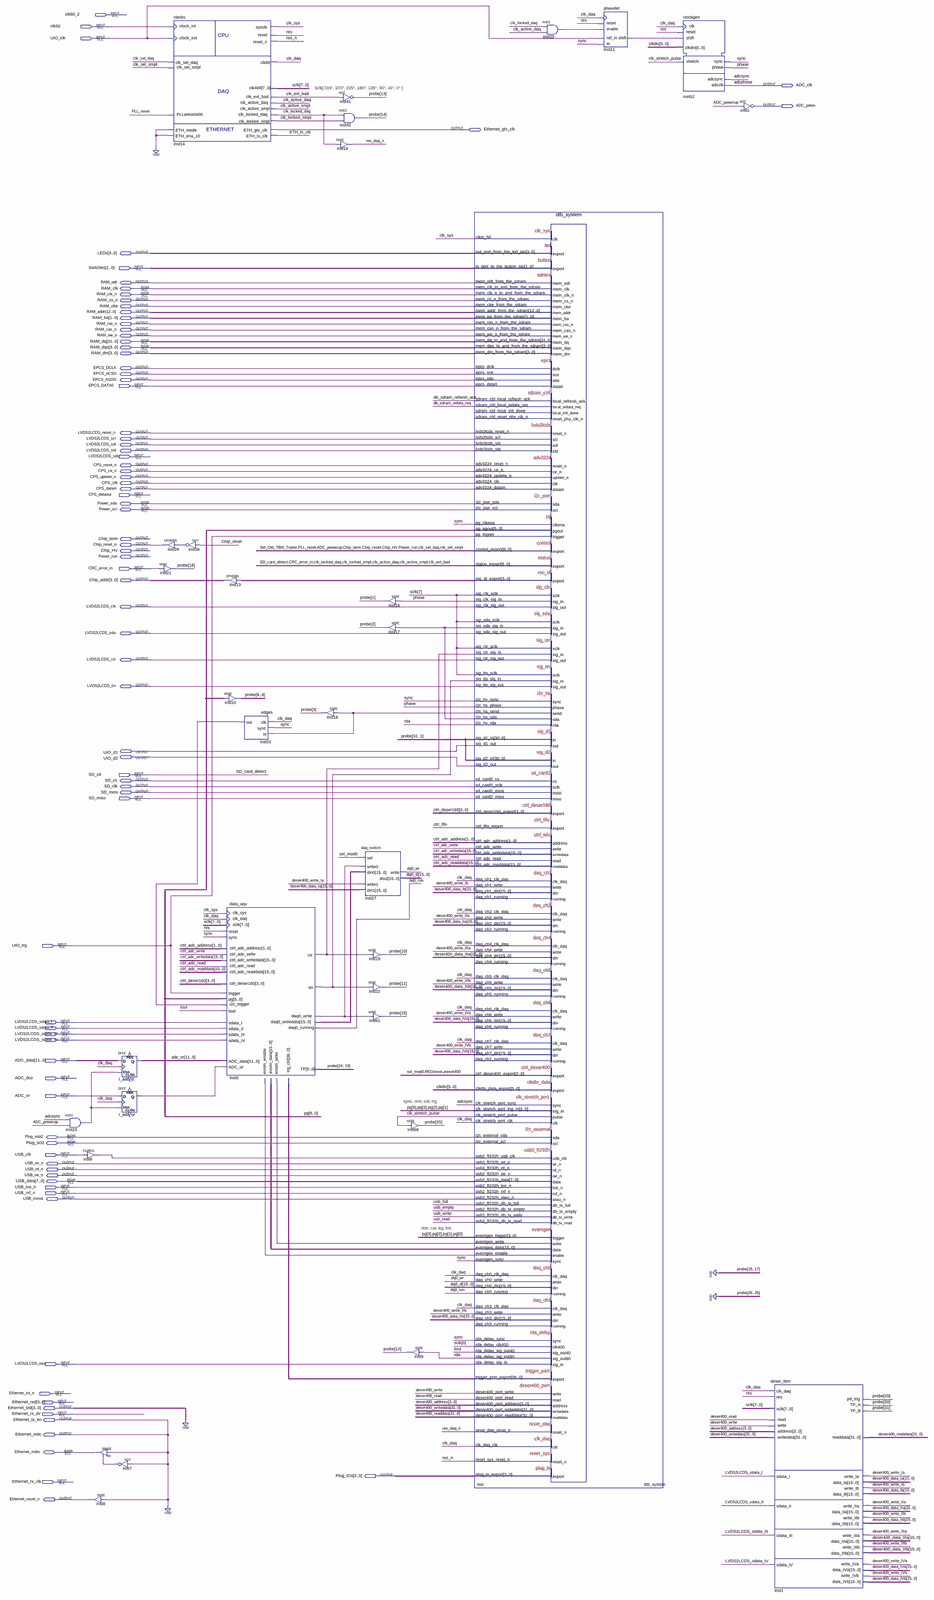
[diagram p0: schematic sheet, whole]
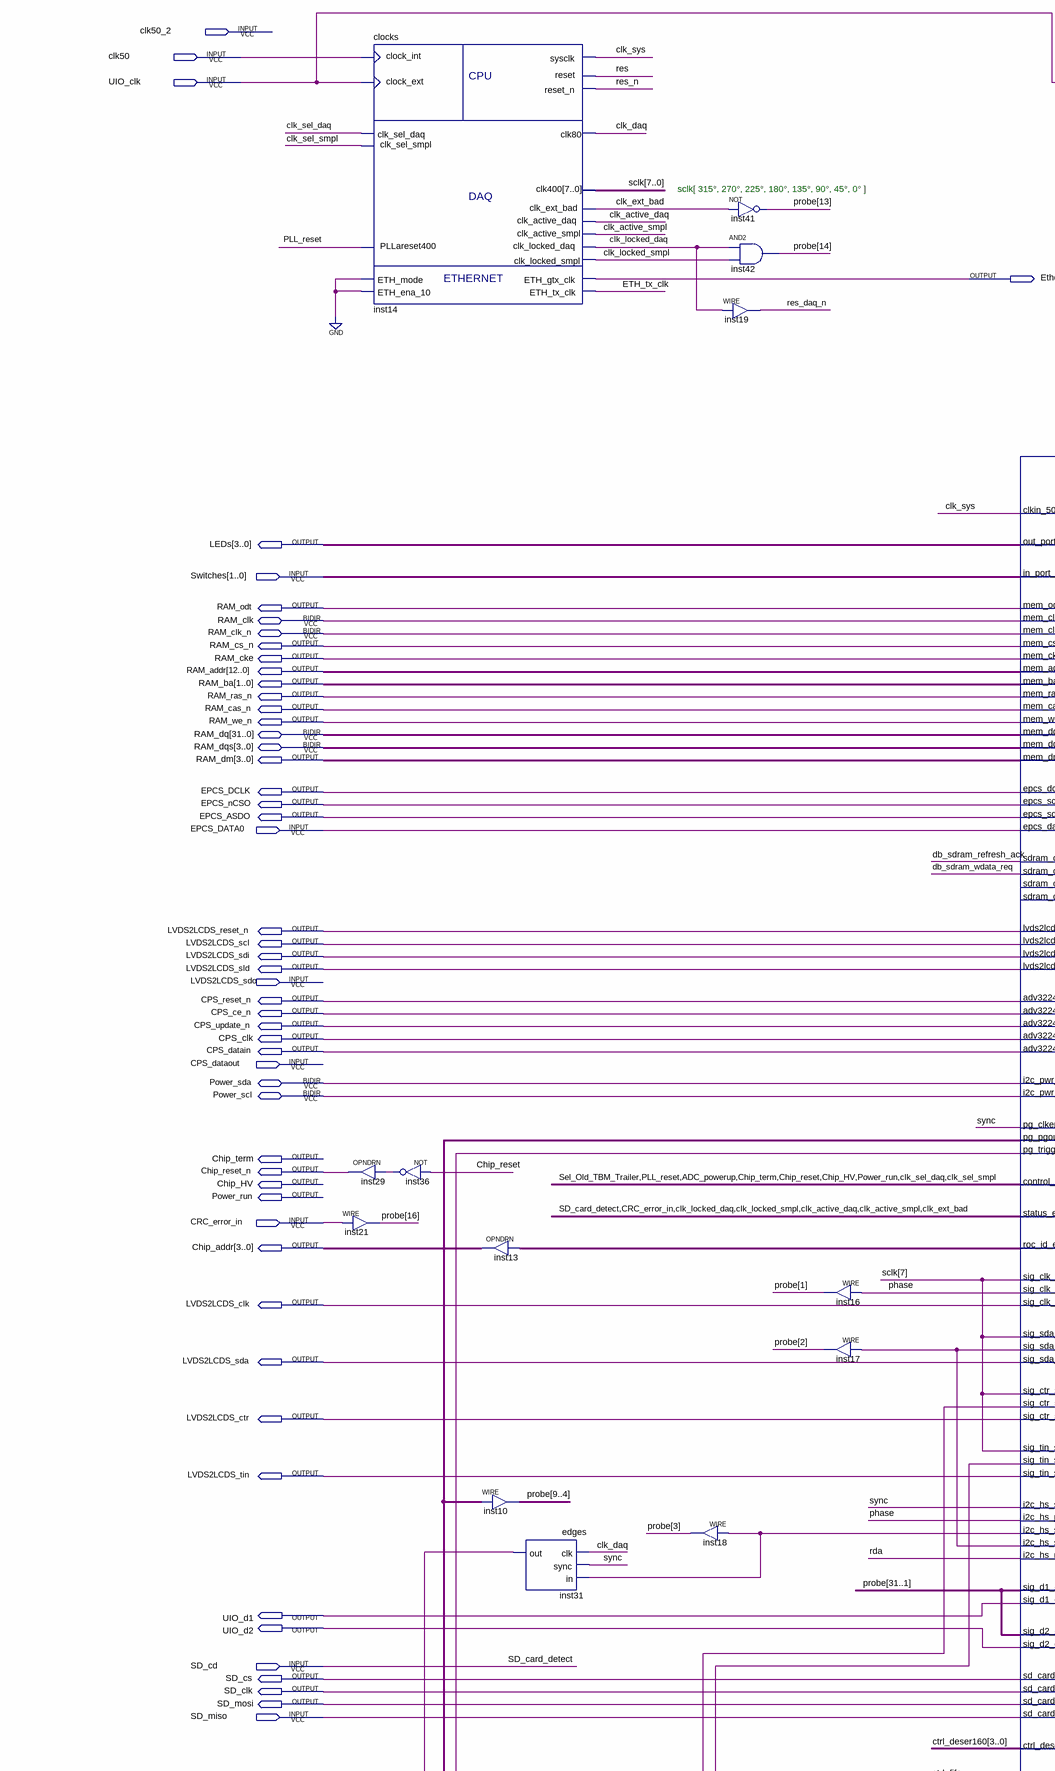
[diagram p1: schematic sheet, upper left part]
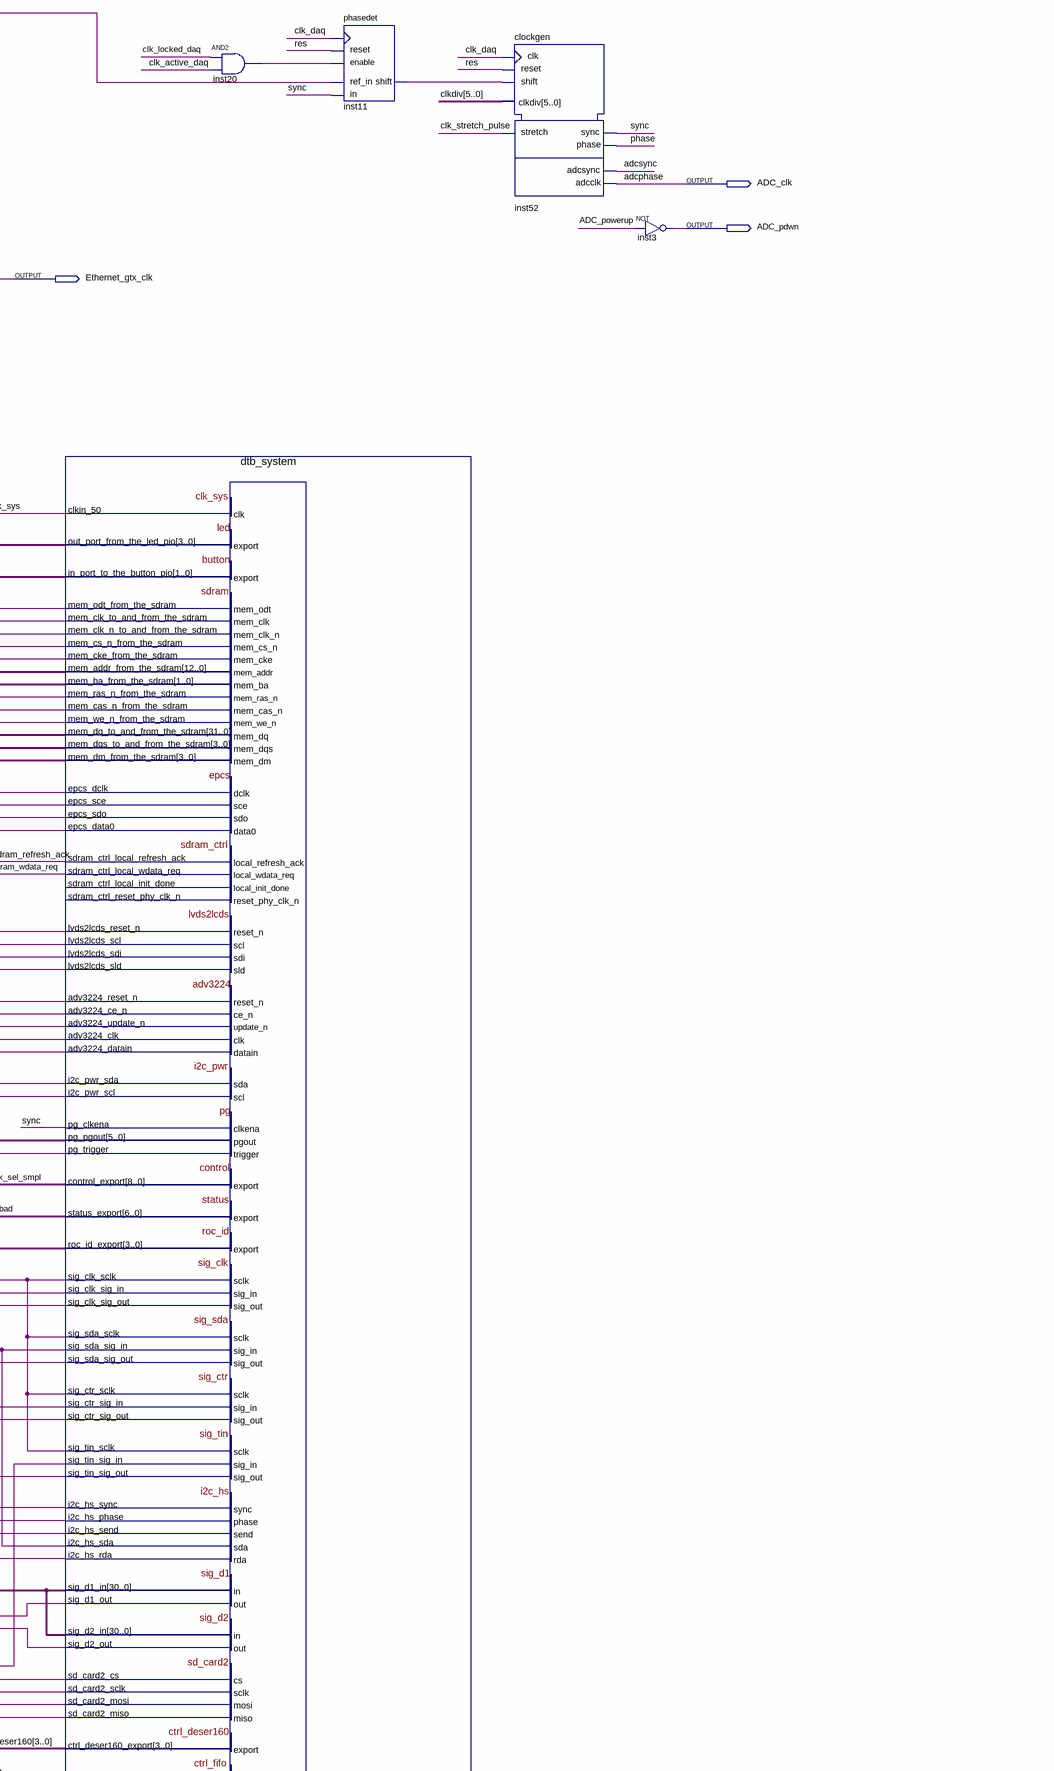
[diagram p2: schematic sheet, upper right part]
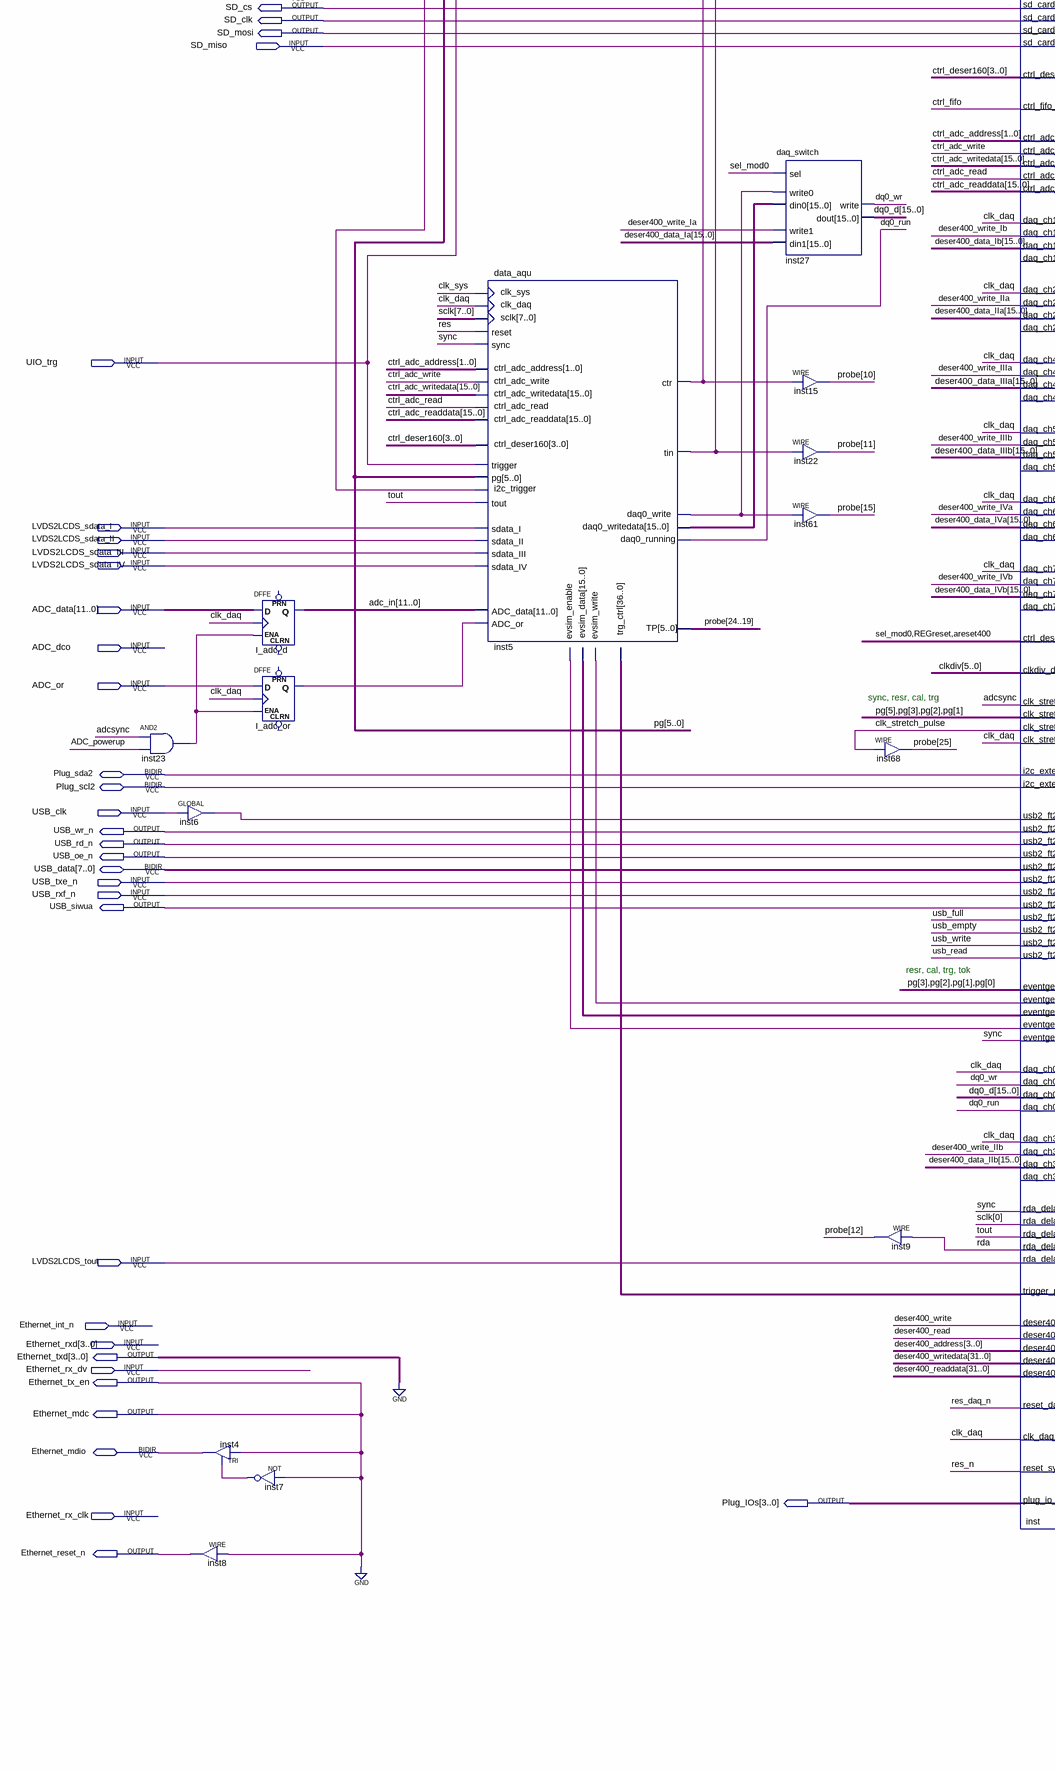
[diagram p3: schematic sheet, lower left part]
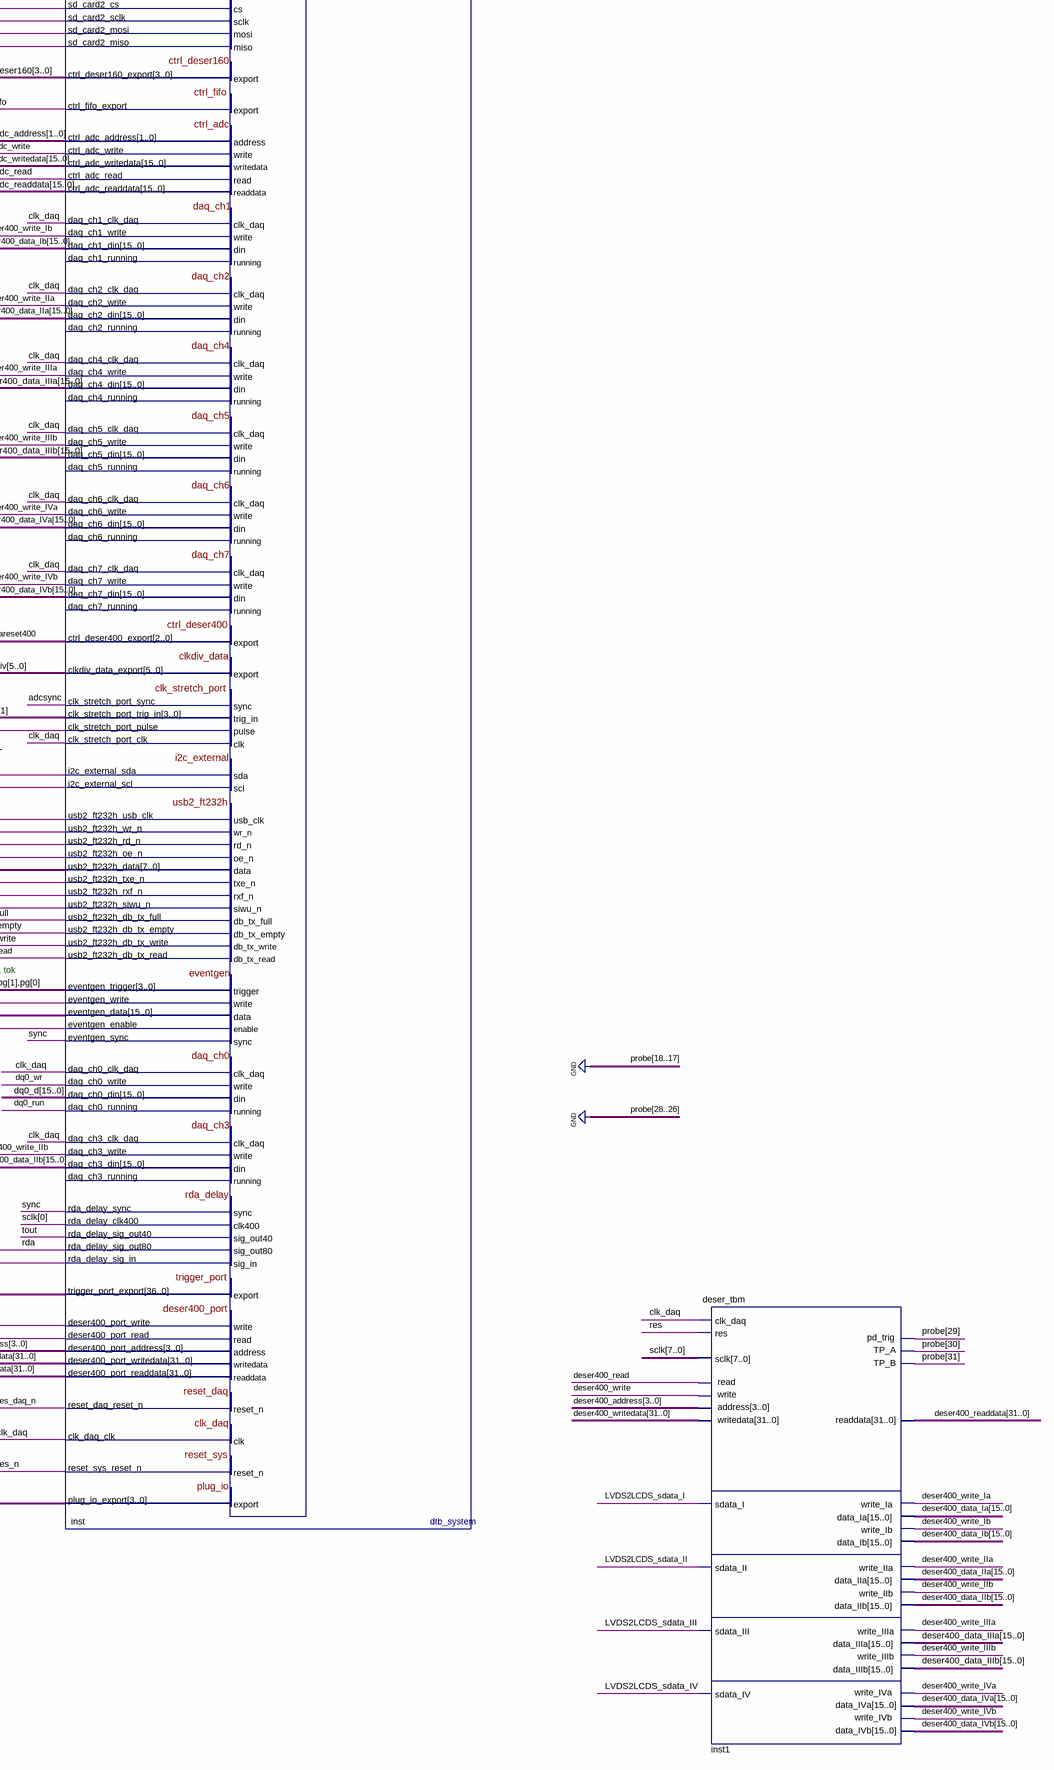
[diagram p4: schematic sheet, lower right part]
// Quartus schematic dtb.bdf as structural Verilog: 33 symbols, 84 pins
module dtb (
  input  clk50_2,
  input  clk50,
  input  UIO_clk,
  input  [1:0] Switches,
  input  EPCS_DATA0,
  input  LVDS2LCDS_sdo,
  input  CPS_dataout,
  input  CRC_error_in,
  input  SD_cd,
  input  SD_miso,
  input  UIO_trg,
  input  LVDS2LCDS_sdata_I,
  input  LVDS2LCDS_sdata_II,
  input  LVDS2LCDS_sdata_III,
  input  LVDS2LCDS_sdata_IV,
  input  [11:0] ADC_data,
  input  ADC_dco,
  input  ADC_or,
  input  USB_clk,
  input  USB_txe_n,
  input  USB_rxf_n,
  input  LVDS2LCDS_tout,
  input  Ethernet_int_n,
  input  [3:0] Ethernet_rxd,
  input  Ethernet_rx_dv,
  input  Ethernet_rx_clk,
  inout  RAM_clk,
  inout  RAM_clk_n,
  inout  [31:0] RAM_dq,
  inout  [3:0] RAM_dqs,
  inout  Power_sda,
  inout  Power_scl,
  inout  Plug_sda2,
  inout  Plug_scl2,
  inout  [7:0] USB_data,
  inout  Ethernet_mdio,
  output ADC_clk,
  output ADC_pdwn,
  output Ethernet_gtx_clk,
  output [3:0] LEDs,
  output RAM_odt,
  output RAM_cs_n,
  output RAM_cke,
  output [12:0] RAM_addr,
  output [1:0] RAM_ba,
  output RAM_ras_n,
  output RAM_cas_n,
  output RAM_we_n,
  output [3:0] RAM_dm,
  output EPCS_DCLK,
  output EPCS_nCSO,
  output EPCS_ASDO,
  output LVDS2LCDS_reset_n,
  output LVDS2LCDS_scl,
  output LVDS2LCDS_sdi,
  output LVDS2LCDS_sld,
  output CPS_reset_n,
  output CPS_ce_n,
  output CPS_update_n,
  output CPS_clk,
  output CPS_datain,
  output Chip_term,
  output Chip_reset_n,
  output Chip_HV,
  output Power_run,
  output [3:0] Chip_addr,
  output LVDS2LCDS_clk,
  output LVDS2LCDS_sda,
  output LVDS2LCDS_ctr,
  output LVDS2LCDS_tin,
  output UIO_d1,
  output UIO_d2,
  output SD_cs,
  output SD_clk,
  output SD_mosi,
  output USB_wr_n,
  output USB_rd_n,
  output USB_oe_n,
  output USB_siwua,
  output [3:0] Ethernet_txd,
  output Ethernet_tx_en,
  output Ethernet_mdc,
  output [3:0] Plug_IOs,
  output Ethernet_reset_n
);

  wire ADC_powerup, adcsync, areset400, Chip_reset, clk_active_daq, clk_active_smpl, clk_daq, clk_ext_bad,
       clk_locked_daq, clk_locked_smpl, clk_sel_daq, clk_sel_smpl, clk_stretch_pulse, clk_sys, ctrl_adc_read,
       ctrl_adc_write, ctrl_fifo, db_sdram_refresh_ack, db_sdram_wdata_req, deser400_read, deser400_write,
       deser400_write_Ia, deser400_write_Ib, deser400_write_IIa, deser400_write_IIb, deser400_write_IIIa,
       deser400_write_IIIb, deser400_write_IVa, deser400_write_IVb, dq0_run, dq0_wr, ETH_tx_clk, I_adc_or_q,
       inst5_ctr, inst5_daq0_write, inst5_tin, inst6_out, inst7_out, inst11_shift, inst20_out, inst23_out,
       inst31_out, inst36_out, inst_eventgen_enable, inst_eventgen_write, inst_i2c_hs_sda, inst_i2c_hs_send,
       phase, PLL_reset, rda, REGreset, res, res_daq_n, res_n, sel_mod0, Sel_Old_TBM_Trailer, sync, tout,
       usb_empty, usb_full, usb_read, usb_write;
  wire [1:0] ctrl_adc_address;
  wire [3:0] ctrl_deser160, deser400_address, inst_roc_id_export;
  wire [5:0] clkdiv, pg;
  wire [7:0] sclk;
  wire [11:0] adc_in;
  wire [15:0] ctrl_adc_readdata, ctrl_adc_writedata, deser400_data_Ia, deser400_data_Ib, deser400_data_IIa,
       deser400_data_IIb, deser400_data_IIIa, deser400_data_IIIb, deser400_data_IVa, deser400_data_IVb,
       dq0_d, inst5_daq0_writedata, inst_eventgen_data;
  wire [31:0] deser400_readdata, deser400_writedata;
  wire [31:1] probe;
  wire [36:0] inst_trigger_port_export;

  and inst23 (inst23_out, adcsync, ADC_powerup);
  GLOBAL inst6 (.IN(USB_clk), .OUT(inst6_out));
  assign Ethernet_reset_n = 1'b0;  // WIRE inst8
  TRI inst4 (.IN(1'b0), .OE(inst7_out), .OUT(Ethernet_mdio));
  DFFE I_adc_d[11:0] (.D(ADC_data), .CLK(clk_daq), .ENA(inst23_out), .Q(adc_in));  // open: PRN, CLRN
  DFFE I_adc_or (.D(ADC_or), .CLK(clk_daq), .ENA(inst23_out), .Q(I_adc_or_q));  // open: PRN, CLRN
  not inst7 (inst7_out, 1'b0);
  assign probe[16] = CRC_error_in;  // WIRE inst21
  clocks inst14 (
    .clock_int(clk50), .clock_ext(UIO_clk), .clk_sel_daq(clk_sel_daq), .ETH_mode(1'b0), .ETH_ena_10(1'b0),
    .PLLareset400(PLL_reset), .clk_sel_smpl(clk_sel_smpl), .sysclk(clk_sys), .reset_n(res_n),
    .ETH_gtx_clk(Ethernet_gtx_clk), .ETH_tx_clk(ETH_tx_clk), .reset(res), .clk80(clk_daq), .clk400(sclk),
    .clk_active_smpl(clk_active_smpl), .clk_active_daq(clk_active_daq), .clk_ext_bad(clk_ext_bad),
    .clk_locked_daq(clk_locked_daq), .clk_locked_smpl(clk_locked_smpl));
  OPNDRN inst29 (.IN(inst36_out), .OUT(Chip_reset_n));
  not inst36 (inst36_out, Chip_reset);
  OPNDRN inst13[3:0] (.IN(inst_roc_id_export), .OUT(Chip_addr));
  assign probe[9:4] = pg;  // WIRE inst10
  data_aqu inst5 (
    .clk_daq(clk_daq), .reset(res), .sync(sync), .trigger(UIO_trg), .tout(tout), .sdata_I(LVDS2LCDS_sdata_I),
    .sdata_II(LVDS2LCDS_sdata_II), .sdata_III(LVDS2LCDS_sdata_III), .sdata_IV(LVDS2LCDS_sdata_IV),
    .ADC_or(I_adc_or_q), .ADC_data(adc_in), .pg(pg), .clk_sys(clk_sys), .sclk(sclk),
    .ctrl_deser160(ctrl_deser160), .daq0_running(dq0_run), .ctrl_adc_address(ctrl_adc_address),
    .ctrl_adc_write(ctrl_adc_write), .ctrl_adc_writedata(ctrl_adc_writedata), .ctrl_adc_read(ctrl_adc_read),
    .i2c_trigger(inst31_out), .evsim_enable(inst_eventgen_enable), .evsim_write(inst_eventgen_write),
    .evsim_data(inst_eventgen_data), .trg_ctrl(inst_trigger_port_export), .ctr(inst5_ctr), .tin(inst5_tin),
    .daq0_write(inst5_daq0_write), .daq0_writedata(inst5_daq0_writedata),
    .ctrl_adc_readdata(ctrl_adc_readdata), .TP(probe[24:19]));
  edges inst31 (.clk(clk_daq), .sync(sync), .in(inst_i2c_hs_send), .out(inst31_out));
  assign probe[3] = inst_i2c_hs_send;  // WIRE inst18
  not inst41 (probe[13], clk_ext_bad);
  and inst42 (probe[14], clk_locked_daq, clk_locked_smpl);
  assign res_daq_n = clk_locked_daq;  // WIRE inst19
  daq_switch inst27 (
    .sel(sel_mod0), .write0(inst5_daq0_write), .din0(inst5_daq0_writedata), .write1(deser400_write_Ia),
    .din1(deser400_data_Ia), .write(dq0_wr), .dout(dq0_d));
  assign probe[10] = inst5_ctr;  // WIRE inst15
  assign probe[11] = inst5_tin;  // WIRE inst22
  assign probe[15] = inst5_daq0_write;  // WIRE inst61
  assign probe[1] = phase;  // WIRE inst16
  assign probe[2] = inst_i2c_hs_sda;  // WIRE inst17
  assign probe[25] = clk_stretch_pulse;  // WIRE inst68
  assign probe[12] = rda;  // WIRE inst9
  dtb_system inst (
    .clkin_50(clk_sys), .in_port_to_the_button_pio(Switches), .epcs_data0(EPCS_DATA0), .pg_clkena(sync),
    .pg_trigger(UIO_trg),
    .status_export({SD_cd, CRC_error_in, clk_locked_daq, clk_locked_smpl, clk_active_daq, clk_active_smpl, clk_ext_bad}),
    .sig_clk_sclk(sclk[7]), .sig_clk_sig_in(phase), .sig_sda_sclk(sclk[7]), .sig_sda_sig_in(inst_i2c_hs_sda),
    .sig_ctr_sclk(sclk[7]), .sig_ctr_sig_in(inst5_ctr), .sig_tin_sclk(sclk[7]), .sig_tin_sig_in(inst5_tin),
    .i2c_hs_sync(sync), .i2c_hs_phase(phase), .i2c_hs_rda(rda),
    .sig_d1_in({probe[31:29], 3'b000, probe[25:19], 2'b00, probe[16:1]}),
    .sig_d2_in({probe[31:29], 3'b000, probe[25:19], 2'b00, probe[16:1]}), .sd_card2_miso(SD_miso),
    .ctrl_adc_readdata(ctrl_adc_readdata), .daq_ch1_clk_daq(clk_daq), .daq_ch1_write(deser400_write_Ib),
    .daq_ch1_din(deser400_data_Ib), .daq_ch2_clk_daq(clk_daq), .daq_ch2_write(deser400_write_IIa),
    .daq_ch2_din(deser400_data_IIa), .daq_ch4_clk_daq(clk_daq), .daq_ch4_write(deser400_write_IIIa),
    .daq_ch4_din(deser400_data_IIIa), .daq_ch5_clk_daq(clk_daq), .daq_ch5_write(deser400_write_IIIb),
    .daq_ch5_din(deser400_data_IIIb), .daq_ch6_clk_daq(clk_daq), .daq_ch6_write(deser400_write_IVa),
    .daq_ch6_din(deser400_data_IVa), .daq_ch7_clk_daq(clk_daq), .daq_ch7_write(deser400_write_IVb),
    .daq_ch7_din(deser400_data_IVb), .clk_stretch_port_sync(adcsync),
    .clk_stretch_port_trig_in({pg[5], pg[3:1]}), .clk_stretch_port_clk(clk_daq),
    .usb2_ft232h_usb_clk(inst6_out), .usb2_ft232h_txe_n(USB_txe_n), .usb2_ft232h_rxf_n(USB_rxf_n),
    .eventgen_trigger(pg[3:0]), .eventgen_sync(sync), .daq_ch0_clk_daq(clk_daq), .daq_ch0_write(dq0_wr),
    .daq_ch0_din(dq0_d), .daq_ch3_clk_daq(clk_daq), .daq_ch3_write(deser400_write_IIb),
    .daq_ch3_din(deser400_data_IIb), .rda_delay_sync(sync), .rda_delay_clk400(sclk[0]),
    .rda_delay_sig_in(LVDS2LCDS_tout), .deser400_port_readdata(deser400_readdata),
    .reset_daq_reset_n(res_daq_n), .clk_daq_clk(clk_daq), .reset_sys_reset_n(res_n),
    .out_port_from_the_led_pio(LEDs), .mem_odt_from_the_sdram(RAM_odt), .mem_cs_n_from_the_sdram(RAM_cs_n),
    .mem_cke_from_the_sdram(RAM_cke), .mem_addr_from_the_sdram(RAM_addr), .mem_ba_from_the_sdram(RAM_ba),
    .mem_ras_n_from_the_sdram(RAM_ras_n), .mem_cas_n_from_the_sdram(RAM_cas_n),
    .mem_we_n_from_the_sdram(RAM_we_n), .mem_dm_from_the_sdram(RAM_dm), .epcs_dclk(EPCS_DCLK),
    .epcs_sce(EPCS_nCSO), .epcs_sdo(EPCS_ASDO), .sdram_ctrl_local_refresh_ack(db_sdram_refresh_ack),
    .sdram_ctrl_local_wdata_req(db_sdram_wdata_req), .lvds2lcds_reset_n(LVDS2LCDS_reset_n),
    .lvds2lcds_scl(LVDS2LCDS_scl), .lvds2lcds_sdi(LVDS2LCDS_sdi), .lvds2lcds_sld(LVDS2LCDS_sld),
    .adv3224_reset_n(CPS_reset_n), .adv3224_ce_n(CPS_ce_n), .adv3224_update_n(CPS_update_n),
    .adv3224_clk(CPS_clk), .adv3224_datain(CPS_datain), .pg_pgout(pg),
    .control_export({Sel_Old_TBM_Trailer, PLL_reset, ADC_powerup, Chip_term, Chip_reset, Chip_HV, Power_run, clk_sel_daq, clk_sel_smpl}),
    .roc_id_export(inst_roc_id_export), .sig_clk_sig_out(LVDS2LCDS_clk), .sig_sda_sig_out(LVDS2LCDS_sda),
    .sig_ctr_sig_out(LVDS2LCDS_ctr), .sig_tin_sig_out(LVDS2LCDS_tin), .i2c_hs_send(inst_i2c_hs_send),
    .i2c_hs_sda(inst_i2c_hs_sda), .sig_d1_out(UIO_d1), .sig_d2_out(UIO_d2), .sd_card2_cs(SD_cs),
    .sd_card2_sclk(SD_clk), .sd_card2_mosi(SD_mosi), .ctrl_deser160_export(ctrl_deser160),
    .ctrl_fifo_export(ctrl_fifo), .ctrl_adc_address(ctrl_adc_address), .ctrl_adc_write(ctrl_adc_write),
    .ctrl_adc_writedata(ctrl_adc_writedata), .ctrl_adc_read(ctrl_adc_read),
    .ctrl_deser400_export({sel_mod0, REGreset, areset400}), .clkdiv_data_export(clkdiv),
    .clk_stretch_port_pulse(clk_stretch_pulse), .usb2_ft232h_wr_n(USB_wr_n), .usb2_ft232h_rd_n(USB_rd_n),
    .usb2_ft232h_oe_n(USB_oe_n), .usb2_ft232h_siwu_n(USB_siwua), .usb2_ft232h_db_tx_full(usb_full),
    .usb2_ft232h_db_tx_empty(usb_empty), .usb2_ft232h_db_tx_write(usb_write),
    .usb2_ft232h_db_tx_read(usb_read), .eventgen_write(inst_eventgen_write),
    .eventgen_data(inst_eventgen_data), .eventgen_enable(inst_eventgen_enable), .daq_ch0_running(dq0_run),
    .rda_delay_sig_out40(tout), .rda_delay_sig_out80(rda), .trigger_port_export(inst_trigger_port_export),
    .deser400_port_write(deser400_write), .deser400_port_read(deser400_read),
    .deser400_port_address(deser400_address), .deser400_port_writedata(deser400_writedata),
    .plug_io_export(Plug_IOs), .mem_clk_to_and_from_the_sdram(RAM_clk),
    .mem_clk_n_to_and_from_the_sdram(RAM_clk_n), .mem_dq_to_and_from_the_sdram(RAM_dq),
    .mem_dqs_to_and_from_the_sdram(RAM_dqs), .i2c_pwr_sda(Power_sda), .i2c_pwr_scl(Power_scl),
    .i2c_external_sda(Plug_sda2), .i2c_external_scl(Plug_scl2), .usb2_ft232h_data(USB_data));  // open: sdram_ctrl_local_init_done, sdram_ctrl_reset_phy_clk_n, daq_ch1_running, daq_ch2_running, daq_ch4_running, daq_ch5_running, daq_ch6_running, daq_ch7_running, daq_ch3_running
  and inst20 (inst20_out, clk_locked_daq, clk_active_daq);
  phasedet inst11 (.in(sync), .clk(clk_daq), .reset(res), .enable(inst20_out), .ref_in(UIO_clk), .shift(inst11_shift));
  clockgen inst52 (
    .clk(clk_daq), .stretch(clk_stretch_pulse), .shift(inst11_shift), .clkdiv(clkdiv), .reset(res),
    .sync(sync), .phase(phase), .adcclk(ADC_clk), .adcsync(adcsync));
  not inst3 (ADC_pdwn, ADC_powerup);
  deser_tbm inst1 (
    .clk_daq(clk_daq), .res(res), .sclk(sclk), .sdata_I(LVDS2LCDS_sdata_I), .sdata_II(LVDS2LCDS_sdata_II),
    .sdata_III(LVDS2LCDS_sdata_III), .sdata_IV(LVDS2LCDS_sdata_IV), .write(deser400_write),
    .read(deser400_read), .address(deser400_address), .writedata(deser400_writedata),
    .data_Ia(deser400_data_Ia), .write_Ia(deser400_write_Ia), .data_Ib(deser400_data_Ib),
    .write_Ib(deser400_write_Ib), .data_IIa(deser400_data_IIa), .write_IIa(deser400_write_IIa),
    .data_IIb(deser400_data_IIb), .write_IIb(deser400_write_IIb), .data_IIIa(deser400_data_IIIa),
    .write_IIIa(deser400_write_IIIa), .data_IIIb(deser400_data_IIIb), .write_IIIb(deser400_write_IIIb),
    .write_IVa(deser400_write_IVa), .data_IVa(deser400_data_IVa), .write_IVb(deser400_write_IVb),
    .data_IVb(deser400_data_IVb), .TP_A(probe[30]), .TP_B(probe[31]), .readdata(deser400_readdata),
    .pd_trig(probe[29]));

  assign Ethernet_mdc = 1'b0;
  assign Ethernet_tx_en = 1'b0;
  assign Ethernet_txd = 4'b0000;

  // Other names for the same wires on the sheet: adcphase = ADC_clk; SD_card_detect = SD_cd

  // Notes on the sheet:
  //   sclk[ 315°, 270°, 225°, 180°, 135°, 90°, 45°, 0° ]
  //   sync, resr, cal, trg
  //   resr, cal, trg, tok
endmodule
